# EAGLE design Adafruit MCP4728 (EAGLE 9.5.1)
COMPANY: ADAFRUIT INDUSTRIES; DRAWN: KTOWN; REV: A
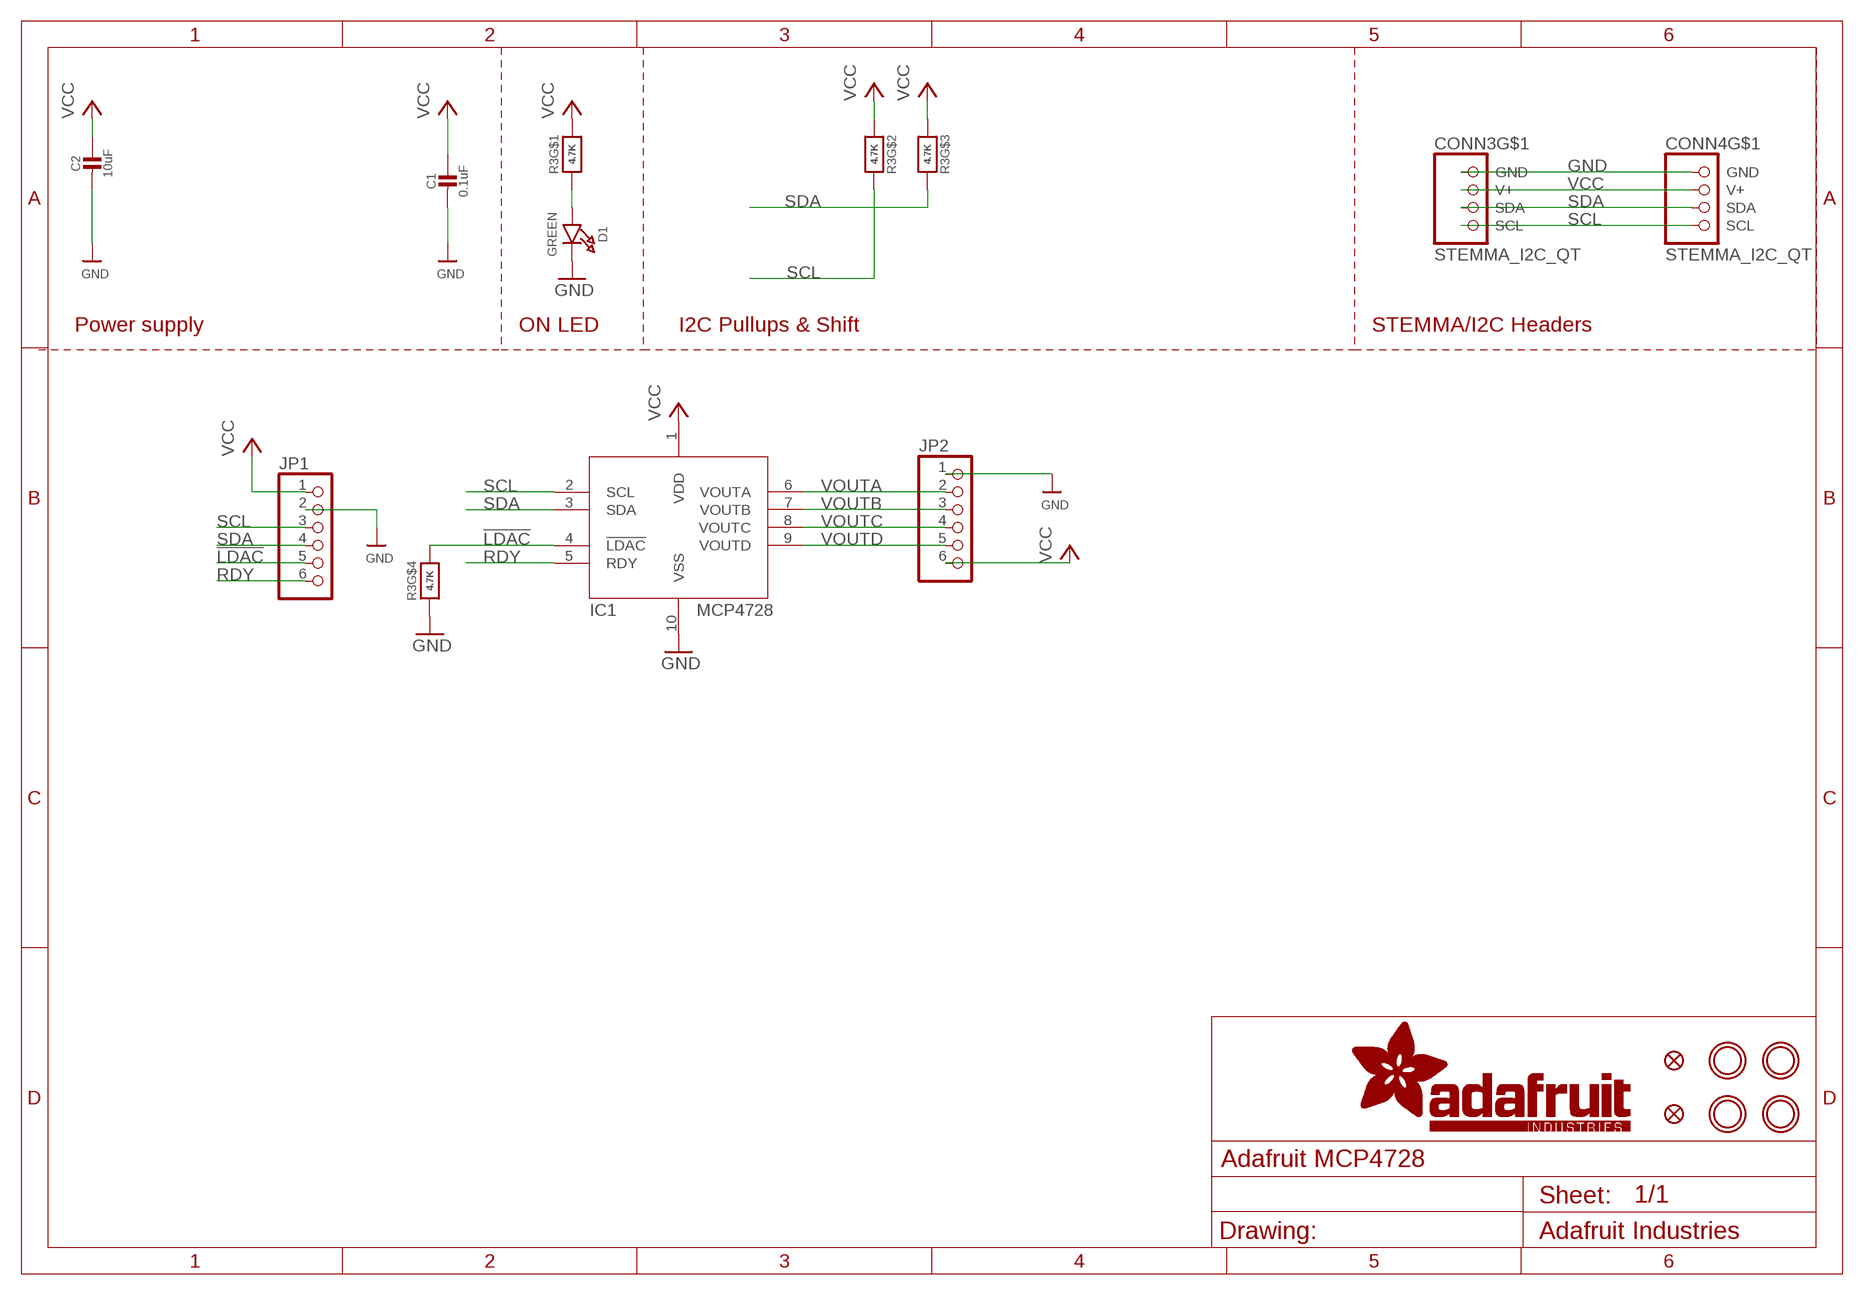
[diagram p0: schematic, sheet 1]

## Parts
C1  0.1uF  CAP_CERAMIC0603_NO  [0603-NO]
C2  10uF  CAP_CERAMIC0805-NOOUTLINE  [0805-NO]
CONN3  STEMMA_I2C_QT  [JST_SH4]
CONN4  STEMMA_I2C_QT  [JST_SH4]
D1  GREEN  LED0603_NOOUTLINE  [CHIPLED_0603_NOOUTLINE]
FID3  FIDUCIAL_1MM  [FIDUCIAL_1MM]
FID4  FIDUCIAL_1MM  [FIDUCIAL_1MM]
IC1  MCP4728  [MSOP10]
JP1  HEADER-1X670MIL  [1X06_ROUND_70]
JP2  HEADER-1X670MIL  [1X06_ROUND_70]
R3  4.7K  RESISTOR_4PACK  [RESPACK_4X0603]
U$1  MOUNTINGHOLE2.5  [MOUNTINGHOLE_2.5_PLATED]
U$17  MOUNTINGHOLE2.5  [MOUNTINGHOLE_2.5_PLATED]
U$19  MOUNTINGHOLE2.5  [MOUNTINGHOLE_2.5_PLATED]
U$21  MOUNTINGHOLE2.5  [MOUNTINGHOLE_2.5_PLATED]

## Nets
!LDAC: IC1.4(!LDAC) JP1.5 R3.5
GND [lowpower]: C1.2 C2.2 CONN3.1(GND) CONN4.1(GND) D1.C IC1.10(VSS) JP1.2 JP2.1 R3.4
N$1: D1.A R3.1
RDY: IC1.5(RDY) JP1.6
SCL: CONN3.4(SCL) CONN4.4(SCL) IC1.2(SCL) JP1.3 R3.7
SDA: CONN3.3(SDA) CONN4.3(SDA) IC1.3(SDA) JP1.4 R3.6
VCC [lowpower]: C1.1 C2.1 CONN3.2(V+) CONN4.2(V+) IC1.1(VDD) JP1.1 JP2.6 R3.2 R3.3 R3.8
VOUTA: IC1.6(VOUTA) JP2.2
VOUTB: IC1.7(VOUTB) JP2.3
VOUTC: IC1.8(VOUTC) JP2.4
VOUTD: IC1.9(VOUTD) JP2.5
Unconnected: CONN3.MT1(MT) CONN3.MT2(MT) CONN4.MT1(MT) CONN4.MT2(MT)

## Notes on the sheet
- Power supply | ON LED | I2C Pullups & Shift | STEMMA/I2C Headers

## Library data of the parts
C1 C2 = microbuilder:CAP_CERAMIC: Ceramic Capacitors For new designs, use the packages preceded by an '_' character since they are more reliable: The following footprints should be used on most boards: _0402 - Standard footprint for regular board layouts _0603 - Standard footprint for regular board layouts _0805 - Standard footprint for regular board layouts _1206 - Standard footprint for regular board layouts For extremely tight-pitch boards where space is at a premium, the following 'micro-pitch' footprints can be used (smaller pads, no silkscreen outline, etc.): _0402MP - Micro-pitch footprint for very dense/compact boards _0603MP - Micro-pitch footprint for very dense/compact boards _0805MP - Micro-pitch footprint for very dense/compact boards _1206MP - Micro-pitch footprint for very dense/compact boards
CONN3 CONN4 = microbuilder:STEMMA_I2C
D1 = microbuilder:LED: LED 0603 - 0603 Surface Mount Package 2mA: Green LED - Low Power (3.9mcd, 2ma, 1.7Vf) - Digikey: 475-2709-2-ND Orange LED - Low Power (9.8mcd, 2ma, 1.8Vf) - Digikey: 475-1194-2-ND Red LED - Low Power (5mcd, 2ma, 1.8Vf) - Digikey: 475-1195-2-ND Yellow LED - Low Power (7mcd, 2ma, 1.8Vf) - Digikey: 475-1196-2-ND 5mA: Blue LED - Low Power (17mcd, 5ma, 2.9Vf) - Digikey: LNJ937W8CRACT-ND 0805 - 0805 Surface Mount Package 2mA: Red LED (8.8mcd, 2mA, 1.8Vf, Clear) - Low Power [Digikey: 475-2510-1-ND] Green LED (5mcd, 2mA, 1.8Vf, Clear) - Low Power [Digikey: 475-2730-1-ND] Yellow LED (11.3mcd, 2mA, 1.8Vf, Clear) - Low Power [Digikey: 475-2555-1-ND] 20mA: Red LED (104mcd, 20mA, Diffused) - LS R976 [Digikey: 475-1278-6-ND] Red LED (12mcd, 20mA, 2.0Vf, Clear) - APT2012EC [Digikey: 754-1128-1-ND] Green LED (15mcd, 20mA, 2.2Vf, Clear) - APT2012GC [Digikey: 754-1131-1-ND] Orange LED (160mcd, 20mA, 2.1Vf, Clear) - APT2012SECK [Digikey: 754-1130-1-ND] 1206 - 1206 Surface Mount Package Green LED (26mcd, 20mA, Diffused) - LG N971 [Digikey: 475-1407-6-ND] Red LED (15mcd, 20mA, Diffused) - LH N974 [Digikey: 475-1416-6-ND] Cree - Cree High-Power Surface Mount LEDs XPEBWT-L1-0000-00D50 - White 111lm 350mA 2.9Vf 6200K 110° XTEAWT-00-0000-00000LEE3 - White 114lm 350mA 2.85Vf 5000K 115° Everlight - Everlight 45-21 Series Surface Mount LEDs 45-21/QK2C-B2832AC2CB2/2T - Warm White 2000mcd 20mA 3.25Vf 3050K 120° 45-21/LK2C-B38452C4CB2/2T - Nuetral White 2000mcd 20mA 3.25Vf 4150K 120° 45-21/LK2C-B50634C6CB2/2T - Cold White 2200mcd 20mA 3.25Vf 5650K 120° PLCC2 Reverse Mount LS T77K-J1L2-1-0-2-R18-Z - Red 11.25mcd 2mA 1.8Vf 630nm 120° LO T77K-L1M2-24-Z - Orange 19.6mcd 2mA 1.8Vf 606nm 120° LY T77K-K2M1-26-Z - Yellow 15.7mcd 2mA 1.8Vf 587nm 120°
FID3 FID4 = microbuilder:FIDUCIAL: Fiducial Alignment Points Various fiducial points for machine vision alignment.; BOM: EXCLUDE
IC1 = microbuilder:MCP4728
JP1 JP2 = microbuilder:HEADER-1X6: PIN HEADER
R3 = microbuilder:RESISTOR_4PACK: Resistor Packs (4 resistors) 4 x 0603 10K 1/16W - Digikey: YC164J-10KCT-ND
U$1 U$17 U$19 U$21 = microbuilder:MOUNTINGHOLE: Mounting Hole For #2 screws (0.086"/2.18mm width, 0.094"/2.4mm hole) use 2.5mm; BOM: EXCLUDE

## Net classes
1 highpower: width 0.406 mm, drill 0.483 mm
2 lowpower: width 0.305 mm, drill 0.483 mm

## Board
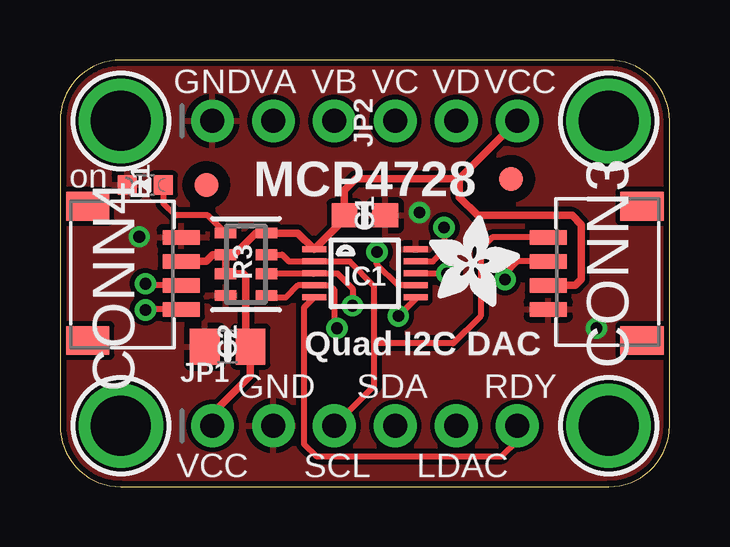
[diagram p1: board, top side]
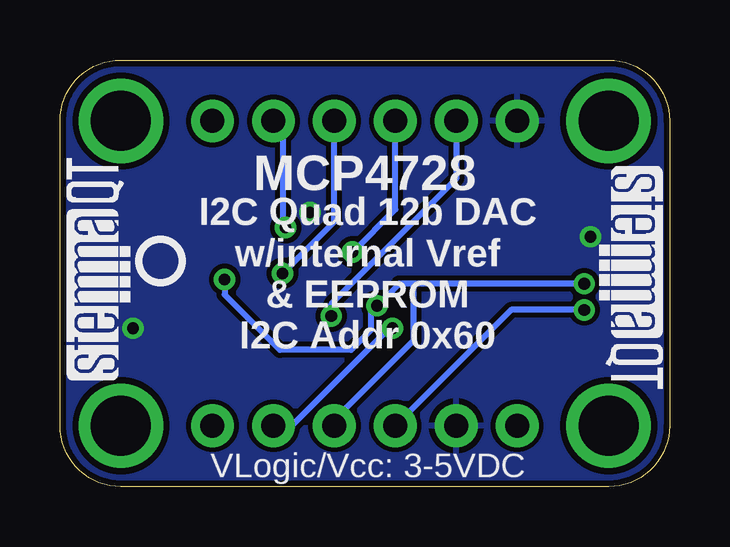
[diagram p2: board, bottom side, seen from below]

Size 25.4 x 17.78 mm. Coordinates in mm from the lower left corner, seen from the top.
Outline: 0,15.24 0,2.54 arc90 2.54,0 22.86,0 arc90 25.4,2.54 25.4,15.24 arc90 22.86,17.78 2.54,17.78 arc90 0,15.24
Copper layers (1*16): Top 0.035mm / dielectric 1.5mm / Bottom 0.035mm
Design rules "adafruit *": minimum track width 8mil, minimum drill 15.5mil, track to track 8mil, track to pad 8mil, pad to pad 8mil, via to via 8mil, smd to smd 8mil, copper to edge 10mil, drill to drill 8mil, minimum pad ring 10mil, minimum via ring 8mil, stop-mask expansion 2mil, vias tented up to drill 20mil, thermal gap 10mil

### Footprints (pad centres in the part's own frame; a part is rotated, then mirrored left to right if it is on the bottom)
0603-NO = smd 1.075 x 1: 1 -0.85,0; 2 0.85,0
0805-NO = smd 1.24 x 1.5: 1 -0.95,0; 2 0.95,0
JST_SH4 = smd 0.6 x 1.55: 1 -1.5,2.514; 2 -0.5,2.514; 3 0.5,2.514; 4 1.5,2.514 | smd 1.2 x 1.8: MT1 -2.8,-1.386; MT2 2.8,-1.386
CHIPLED_0603_NOOUTLINE = smd 0.8 x 0.8: A 0,-0.75; C 0,0.75
FIDUCIAL_1MM = smd 1 x 1: 1 0,0
MSOP10 = smd 0.25 x 1: 1 -1,-2.113; 2 -0.5,-2.113; 3 0,-2.113; 4 0.5,-2.113; 5 1,-2.113; 6 1,2.113; 7 0.5,2.113; 8 0,2.113; 9 -0.5,2.113; 10 -1,2.113
1X06_ROUND_70 = drill 1 pad 1.778: 1 -6.35,0; 2 -3.81,0; 3 -1.27,0; 4 1.27,0; 5 3.81,0; 6 6.35,0
RESPACK_4X0603 = smd 0.45 x 0.9: 1 -1.3,-0.85; 2 -0.4,-0.85; 3 0.4,-0.85; 4 1.3,-0.85; 5 1.3,0.85; 6 0.4,0.85; 7 -0.4,0.85; 8 -1.3,0.85
MOUNTINGHOLE_2.5_PLATED = drill 2.5 pad 3.2: P$1 0,0

### Placement (x,y rotation side)
C1  12.7,11.3 0 top
C2  6.99,5.84 180 top
CONN3  22.86,8.89 90 top
CONN4  2.54,8.89 270 top
D1  3.56,12.57 90 top
FID3  6.1,12.57 0 top
FID4  18.8,12.83 0 top
IC1  12.7,8.89 270 top
JP1  12.7,2.54 0 top
JP2  12.7,15.24 0 top
R3  7.75,9.27 270 top
U$1  2.54,15.24 0 top
U$17  22.86,15.24 0 top
U$19  2.54,2.54 0 top
U$21  22.86,2.54 0 top
U$22  [ADAFRUIT_3.5MM]  15.37,7.49 0 top
U$25  [PCBFEAT-REV-040]  21.21,9.4 0 bottom
U$30  [STEMMAQT]  22.48,4.45 90 bottom
U$31  [STEMMAQT]  2.92,13.34 270 bottom

### Tracks (layer width: path | path; a pad name or v marks a point on that pad's centre or on a via)
!LDAC  (via drill 0.48)
  Top 0.254: R3.5 8.69,7.87 9.4,7.87 9.91,8.39 IC1.4 11.25,8.39 11.42,8.22 11.42,6.73 v11.54,6.6
  Bottom 0.254: v11.54,6.6 11.68,6.6 15.75,2.54 JP1.5
GND  (via drill 0.48)
  other vias: 3.3,10.41 14.99,11.43 22.35,6.6
  pour Top: 0,17.78 25.4,17.78 25.4,0 0,0
  pour Bottom: 0,17.78 25.4,17.78 25.4,0 0,0
N$1
  Top 0.254: D1.A 4.31,11.81 4.81,11.3 6.17,11.3 R3.1
RDY
  Top 0.254: IC1.5 10.16,7.46 10.16,1.78 10.67,1.27 18.41,1.27 19.05,1.91 JP1.6
SCL  (via drill 0.48)
  Top 0.254: R3.7 9.25,9.67 9.53,9.39 IC1.2 12.07,9.39 13.08,8.38 13.08,5.97 | CONN4.4 3.58,7.39 v3.56,7.37 | JP1.3 13.08,4.19 13.08,5.97 | CONN3.4 18.01,10.39 17.53,9.91 17.53,7.11 16.38,5.97 13.08,5.97
  Bottom 0.254: v3.56,7.37 6.6,7.37 JP1.3
SDA  (via drill 0.48)
  Top 0.254: R3.6 10.57,8.87 IC1.3 11.56,8.89 12.19,8.26 v12.19,7.54 | CONN4.3 3.62,8.39 v3.56,8.46 | CONN3.3 19.08,9.39 18.54,8.86 v18.54,8.64
  Bottom 0.254: v3.56,8.46 10.67,8.46 | 10.67,8.46 11.27,8.46 v12.19,7.54 12.45,7.29 12.45,6.52 13.27,5.7 16.24,5.7 18.54,8 v18.54,8.64 | JP1.4 13.97,2.79 10.67,6.1 10.67,8.46
VCC
  Top 0.305: CONN4.2 6.09,9.39 6.37,9.67 R3.2 | R3.2 R3.3 7.64,8.87 7.75,8.76 7.75,6.03 C2.1 7.93,4.63 6.35,3.05 JP1.1 | R3.2 7.26,9.67 8.16,10.57 R3.8 9.91,10.57 IC1.1 11.85,11.15 C1.1 11.85,12.36 12.32,12.83 16.64,12.83 | 16.64,12.83 JP2.6 | CONN3.2 21.47,8.39 21.72,8.64 21.72,10.92 21.34,11.3 17.4,11.3 16.64,12.06 16.64,12.83
VOUTA  (via drill 0.48)
  Top 0.254: IC1.6 14.81,7.83 v14.1,7.11
  Bottom 0.254: v14.1,7.11 14.1,7.62 8.89,12.83 JP2.2
VOUTB  (via drill 0.48)
  Top 0.254: IC1.7 14.09,8.39 13.21,9.27 v13.21,9.78
  Bottom 0.254: v13.21,9.78 11.43,11.56 JP2.3
VOUTC  (via drill 0.48)
  Top 0.254: IC1.8 v16.13,8.89
  Bottom 0.254: v16.13,8.89 13.97,11.05 JP2.4
VOUTD  (via drill 0.48)
  Top 0.254: IC1.9 15.53,9.39 16,9.86 v16,10.79
  Bottom 0.254: v16,10.79 16.13,10.92 16.13,14.86 JP2.5

### Text on the board
tPlace: GND | VA | VB | VC | VD | VCC | MCP4728 | on | Quad I2C DAC | GND | SDA | RDY | VCC | SCL | LDAC
bPlace: MCP4728 | I2C Quad 12b DAC / w/internal Vref / & EEPROM / I2C Addr 0x60 | VLogic/Vcc: 3-5VDC